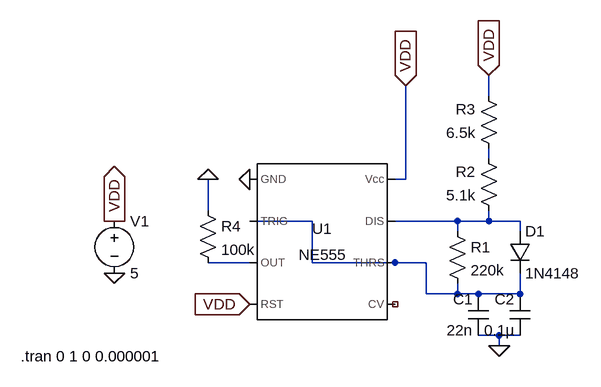
[diagram p0: schematic servo_esc_driver.asc]
servo_esc_driver.asc, the LTspice schematic file:
Version 4
SHEET 1 880 680
WIRE 384 -48 384 -80
WIRE 384 48 384 32
WIRE 256 80 256 -64
WIRE 256 80 240 80
WIRE -48 128 -48 80
WIRE 112 144 16 144
WIRE 336 144 240 144
WIRE 384 144 384 128
WIRE 384 144 336 144
WIRE 432 144 384 144
WIRE 336 160 336 144
WIRE 432 160 432 144
WIRE 16 208 -48 208
WIRE 112 208 112 144
WIRE 240 208 112 208
WIRE 288 208 240 208
WIRE 288 256 288 208
WIRE 336 256 336 240
WIRE 336 256 288 256
WIRE 368 256 336 256
WIRE 432 256 432 224
WIRE 432 256 368 256
WIRE 400 320 368 320
WIRE 432 320 400 320
WIRE 400 336 400 320
FLAG -192 224 0
FLAG 16 80 0
FLAG -192 144 VDD
IOPIN -192 144 Out
FLAG 16 272 VDD
IOPIN 16 272 In
FLAG 400 336 0
FLAG 384 -80 VDD
IOPIN 384 -80 In
FLAG -48 80 0
FLAG 256 -64 VDD
IOPIN 256 -64 In
SYMBOL Misc\\NE555 128 176 R0
SYMATTR InstName U1
SYMBOL voltage -192 128 R0
WINDOW 123 0 0 Left 0
WINDOW 39 0 0 Left 0
SYMATTR InstName V1
SYMATTR Value 5
SYMBOL diode 416 160 R0
SYMATTR InstName D1
SYMATTR Value 1N4148
SYMBOL cap 384 320 R180
WINDOW 0 24 56 Left 2
WINDOW 3 24 8 Left 2
SYMATTR InstName C1
SYMATTR Value 22n
SYMBOL cap 448 320 R180
WINDOW 0 24 56 Left 2
WINDOW 3 24 8 Left 2
SYMATTR InstName C2
SYMATTR Value 0.1µ
SYMBOL res 320 144 R0
SYMATTR InstName R1
SYMATTR Value 220k
SYMBOL res 400 144 R180
WINDOW 0 36 76 Left 2
WINDOW 3 36 40 Left 2
SYMATTR InstName R2
SYMATTR Value 5.1k
SYMBOL res 400 48 R180
WINDOW 0 36 76 Left 2
WINDOW 3 36 40 Left 2
SYMATTR InstName R3
SYMATTR Value 6.5k
SYMBOL res -64 112 R0
SYMATTR InstName R4
SYMATTR Value 100k
TEXT -336 352 Left 2 !.tran 0 1 0 0.000001

The netlist it stands for:
* servo_esc_driver.asc
XU1 0 N002 N004 VDD NC_01 N002 N003 VDD NE555  ; pins GND TRIG OUT RST CV THRS DIS Vcc
V1 VDD 0 5
D1 N003 N002 1N4148
C1 0 N002 22n
C2 0 N002 0.1µ
R1 N003 N002 220k
R2 N003 N001 5.1k
R3 N001 VDD 6.5k
R4 0 N004 100k
.model D D
.lib standard.dio
.tran 0 1 0 0.000001
.lib NE555.sub
.backanno
.end